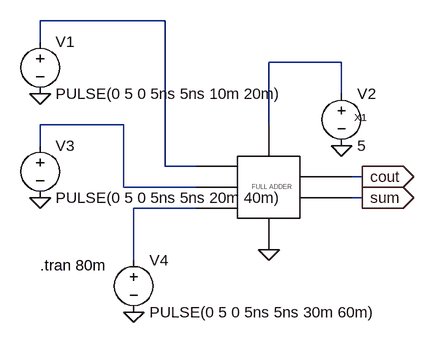
[diagram p0: schematic fulladderimplytest.asc]
fulladderimplytest.asc, the LTspice schematic file:
Version 4
SHEET 1 880 680
WIRE 64 -96 -128 -96
WIRE -128 -64 -128 -96
WIRE 336 -32 224 -32
WIRE 336 16 336 -32
WIRE 0 64 -128 64
WIRE 224 64 224 -32
WIRE -128 96 -128 64
WIRE 64 128 64 -96
WIRE 112 128 64 128
WIRE 368 144 352 144
WIRE 0 160 0 64
WIRE 112 160 0 160
WIRE 368 176 352 176
WIRE 112 192 16 192
WIRE 16 272 16 192
FLAG 224 256 0
FLAG 336 96 0
FLAG 368 144 cout
IOPIN 368 144 Out
FLAG 368 176 sum
IOPIN 368 176 Out
FLAG -128 16 0
FLAG -128 176 0
FLAG 16 352 0
SYMBOL fulladderimply 224 160 R0
SYMATTR InstName X1
SYMBOL voltage 336 0 R0
WINDOW 123 0 0 Left 0
WINDOW 39 0 0 Left 0
SYMATTR InstName V2
SYMATTR Value 5
SYMBOL voltage -128 -80 R0
WINDOW 123 0 0 Left 0
WINDOW 39 0 0 Left 0
SYMATTR InstName V1
SYMATTR Value PULSE(0 5 0 5ns 5ns 10m 20m)
SYMBOL voltage -128 80 R0
WINDOW 123 0 0 Left 0
WINDOW 39 0 0 Left 0
SYMATTR InstName V3
SYMATTR Value PULSE(0 5 0 5ns 5ns 20m 40m)
SYMBOL voltage 16 256 R0
WINDOW 123 0 0 Left 0
WINDOW 39 0 0 Left 0
SYMATTR InstName V4
SYMATTR Value PULSE(0 5 0 5ns 5ns 30m 60m)
TEXT -128 280 Left 2 !.tran 80m

The netlist it stands for:
* fulladderimplytest.asc
XX1 N001 N003 N004 N002 0 sum cout fulladderimply  ; pins A B C VDD VSS CARRY SUM
V2 N002 0 5
V1 N001 0 PULSE(0 5 0 5ns 5ns 10m 20m)
V3 N003 0 PULSE(0 5 0 5ns 5ns 20m 40m)
V4 N004 0 PULSE(0 5 0 5ns 5ns 30m 60m)
.tran 80m
.backanno
.end